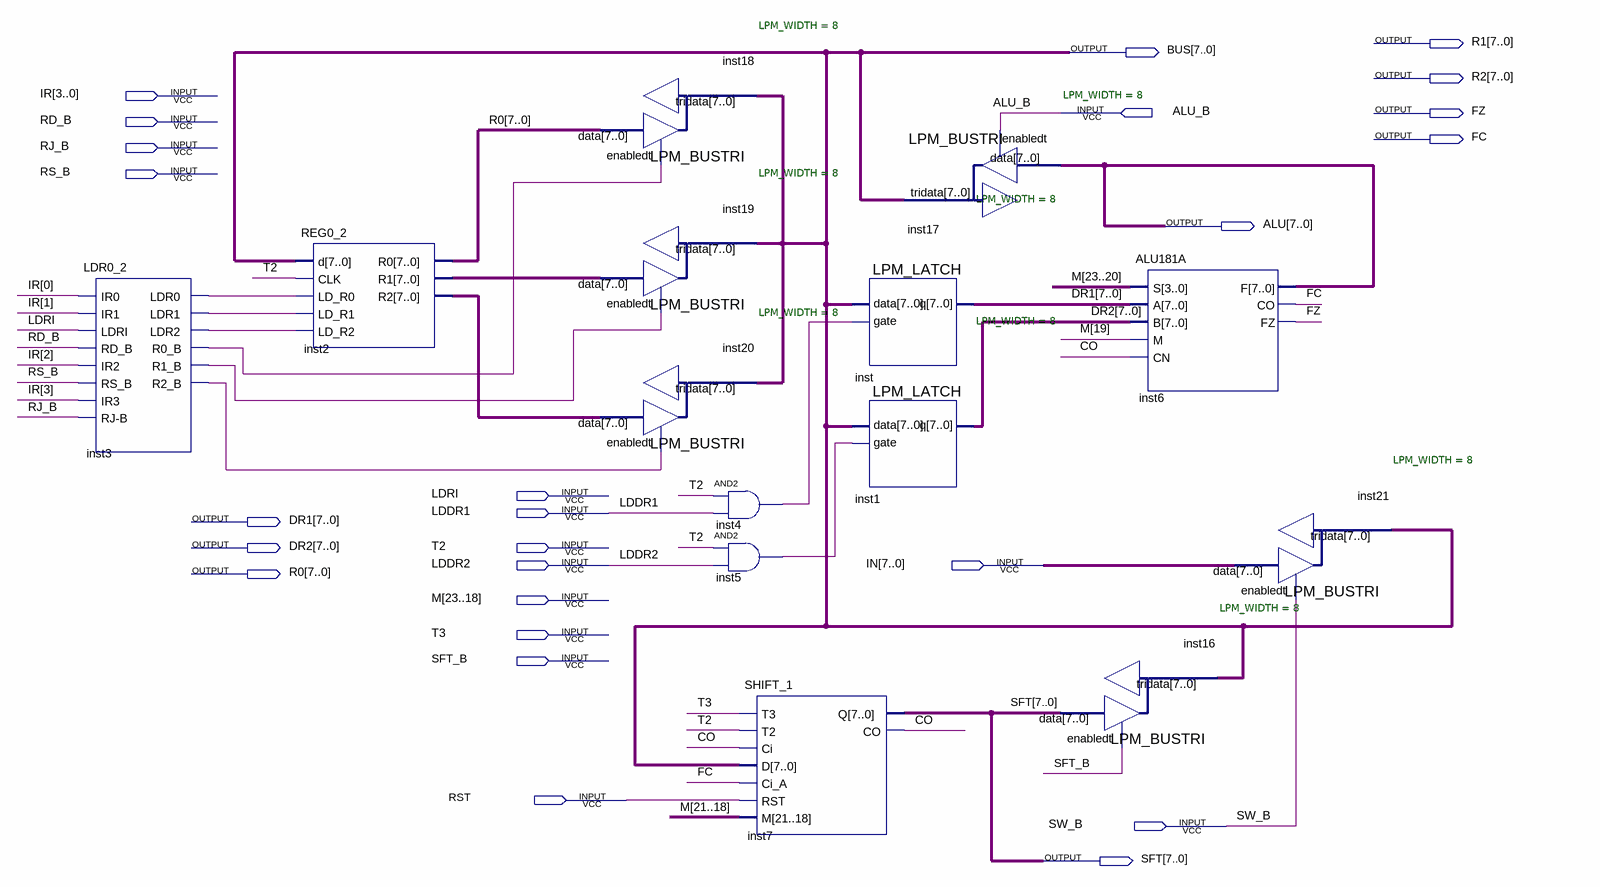
[diagram p0: schematic sheet]
// Quartus schematic ALU_MD.bdf as structural Verilog: 14 symbols, 25 pins
module ALU_MD (
  input  [3:0] IR,
  input  ALU_B,
  input  RD_B,
  input  RJ_B,
  input  RS_B,
  input  LDRI,
  input  LDDR1,
  input  T2,
  input  LDDR2,
  input  [7:0] IN,
  input  [23:18] M,
  input  T3,
  input  SFT_B,
  input  RST,
  input  SW_B,
  output [7:0] R1,
  output [7:0] BUS,
  output [7:0] R2,
  output FZ,
  output FC,
  output [7:0] ALU,
  output [7:0] DR1,
  output [7:0] DR2,
  output [7:0] R0,
  output [7:0] SFT
);

  wire CO, inst3_ldr0, inst3_ldr1, inst3_ldr2, inst3_r0_b, inst3_r1_b, inst3_r2_b, inst4_out, inst5_out;
  wire [7:0] inst2_r1, inst2_r2;

  LDR0_2 inst3 (
    .IR0(IR[0]), .IR1(IR[1]), .LDRI(LDRI), .RD_B(RD_B), .IR2(IR[2]), .RS_B(RS_B), .IR3(IR[3]), .\RJ-B (RJ_B),
    .LDR0(inst3_ldr0), .LDR1(inst3_ldr1), .LDR2(inst3_ldr2), .R0_B(inst3_r0_b), .R1_B(inst3_r1_b),
    .R2_B(inst3_r2_b));
  REG0_2 inst2 (
    .d(BUS), .CLK(T2), .LD_R0(inst3_ldr0), .LD_R1(inst3_ldr1), .LD_R2(inst3_ldr2), .R0(R0), .R1(inst2_r1),
    .R2(inst2_r2));
  LPM_BUSTRI #(.LPM_WIDTH(8)) inst18 (.data(R0), .enabledt(inst3_r0_b), .tridata(BUS));
  LPM_BUSTRI #(.LPM_WIDTH(8)) inst19 (.data(inst2_r1), .enabledt(inst3_r1_b), .tridata(BUS));
  LPM_BUSTRI #(.LPM_WIDTH(8)) inst20 (.data(inst2_r2), .enabledt(inst3_r2_b), .tridata(BUS));
  and inst4 (inst4_out, T2, LDDR1);
  and inst5 (inst5_out, T2, LDDR2);
  SHIFT_1 inst7 (.T3(T3), .T2(T2), .Ci(CO), .D(BUS), .Ci_A(FC), .RST(RST), .M(M[21:18]), .Q(SFT), .CO(CO));
  LPM_BUSTRI #(.LPM_WIDTH(8)) inst17 (.data(ALU), .enabledt(ALU_B), .tridata(BUS));
  LPM_LATCH #(.LPM_WIDTH(8)) inst (.data(BUS), .gate(inst4_out), .q(DR1));
  LPM_LATCH #(.LPM_WIDTH(8)) inst1 (.data(BUS), .gate(inst5_out), .q(DR2));
  LPM_BUSTRI #(.LPM_WIDTH(8)) inst16 (.data(SFT), .enabledt(SFT_B), .tridata(BUS));
  ALU181A inst6 (.S(M[23:20]), .A(DR1), .B(DR2), .M(M[19]), .CN(CO), .F(ALU), .CO(FC), .FZ(FZ));
  LPM_BUSTRI #(.LPM_WIDTH(8)) inst21 (.data(IN), .enabledt(SW_B), .tridata(BUS));
endmodule
